# EasyEDA schematic RC Car Project Remote.json
TITLE: RC Car Project REMOTE; REV: 1.1; Date: 26/09/2022; Sheet: 1/1; Drawn By: Hugo MATHIEU; Company: BUT R&T, Aix-Marseille Université
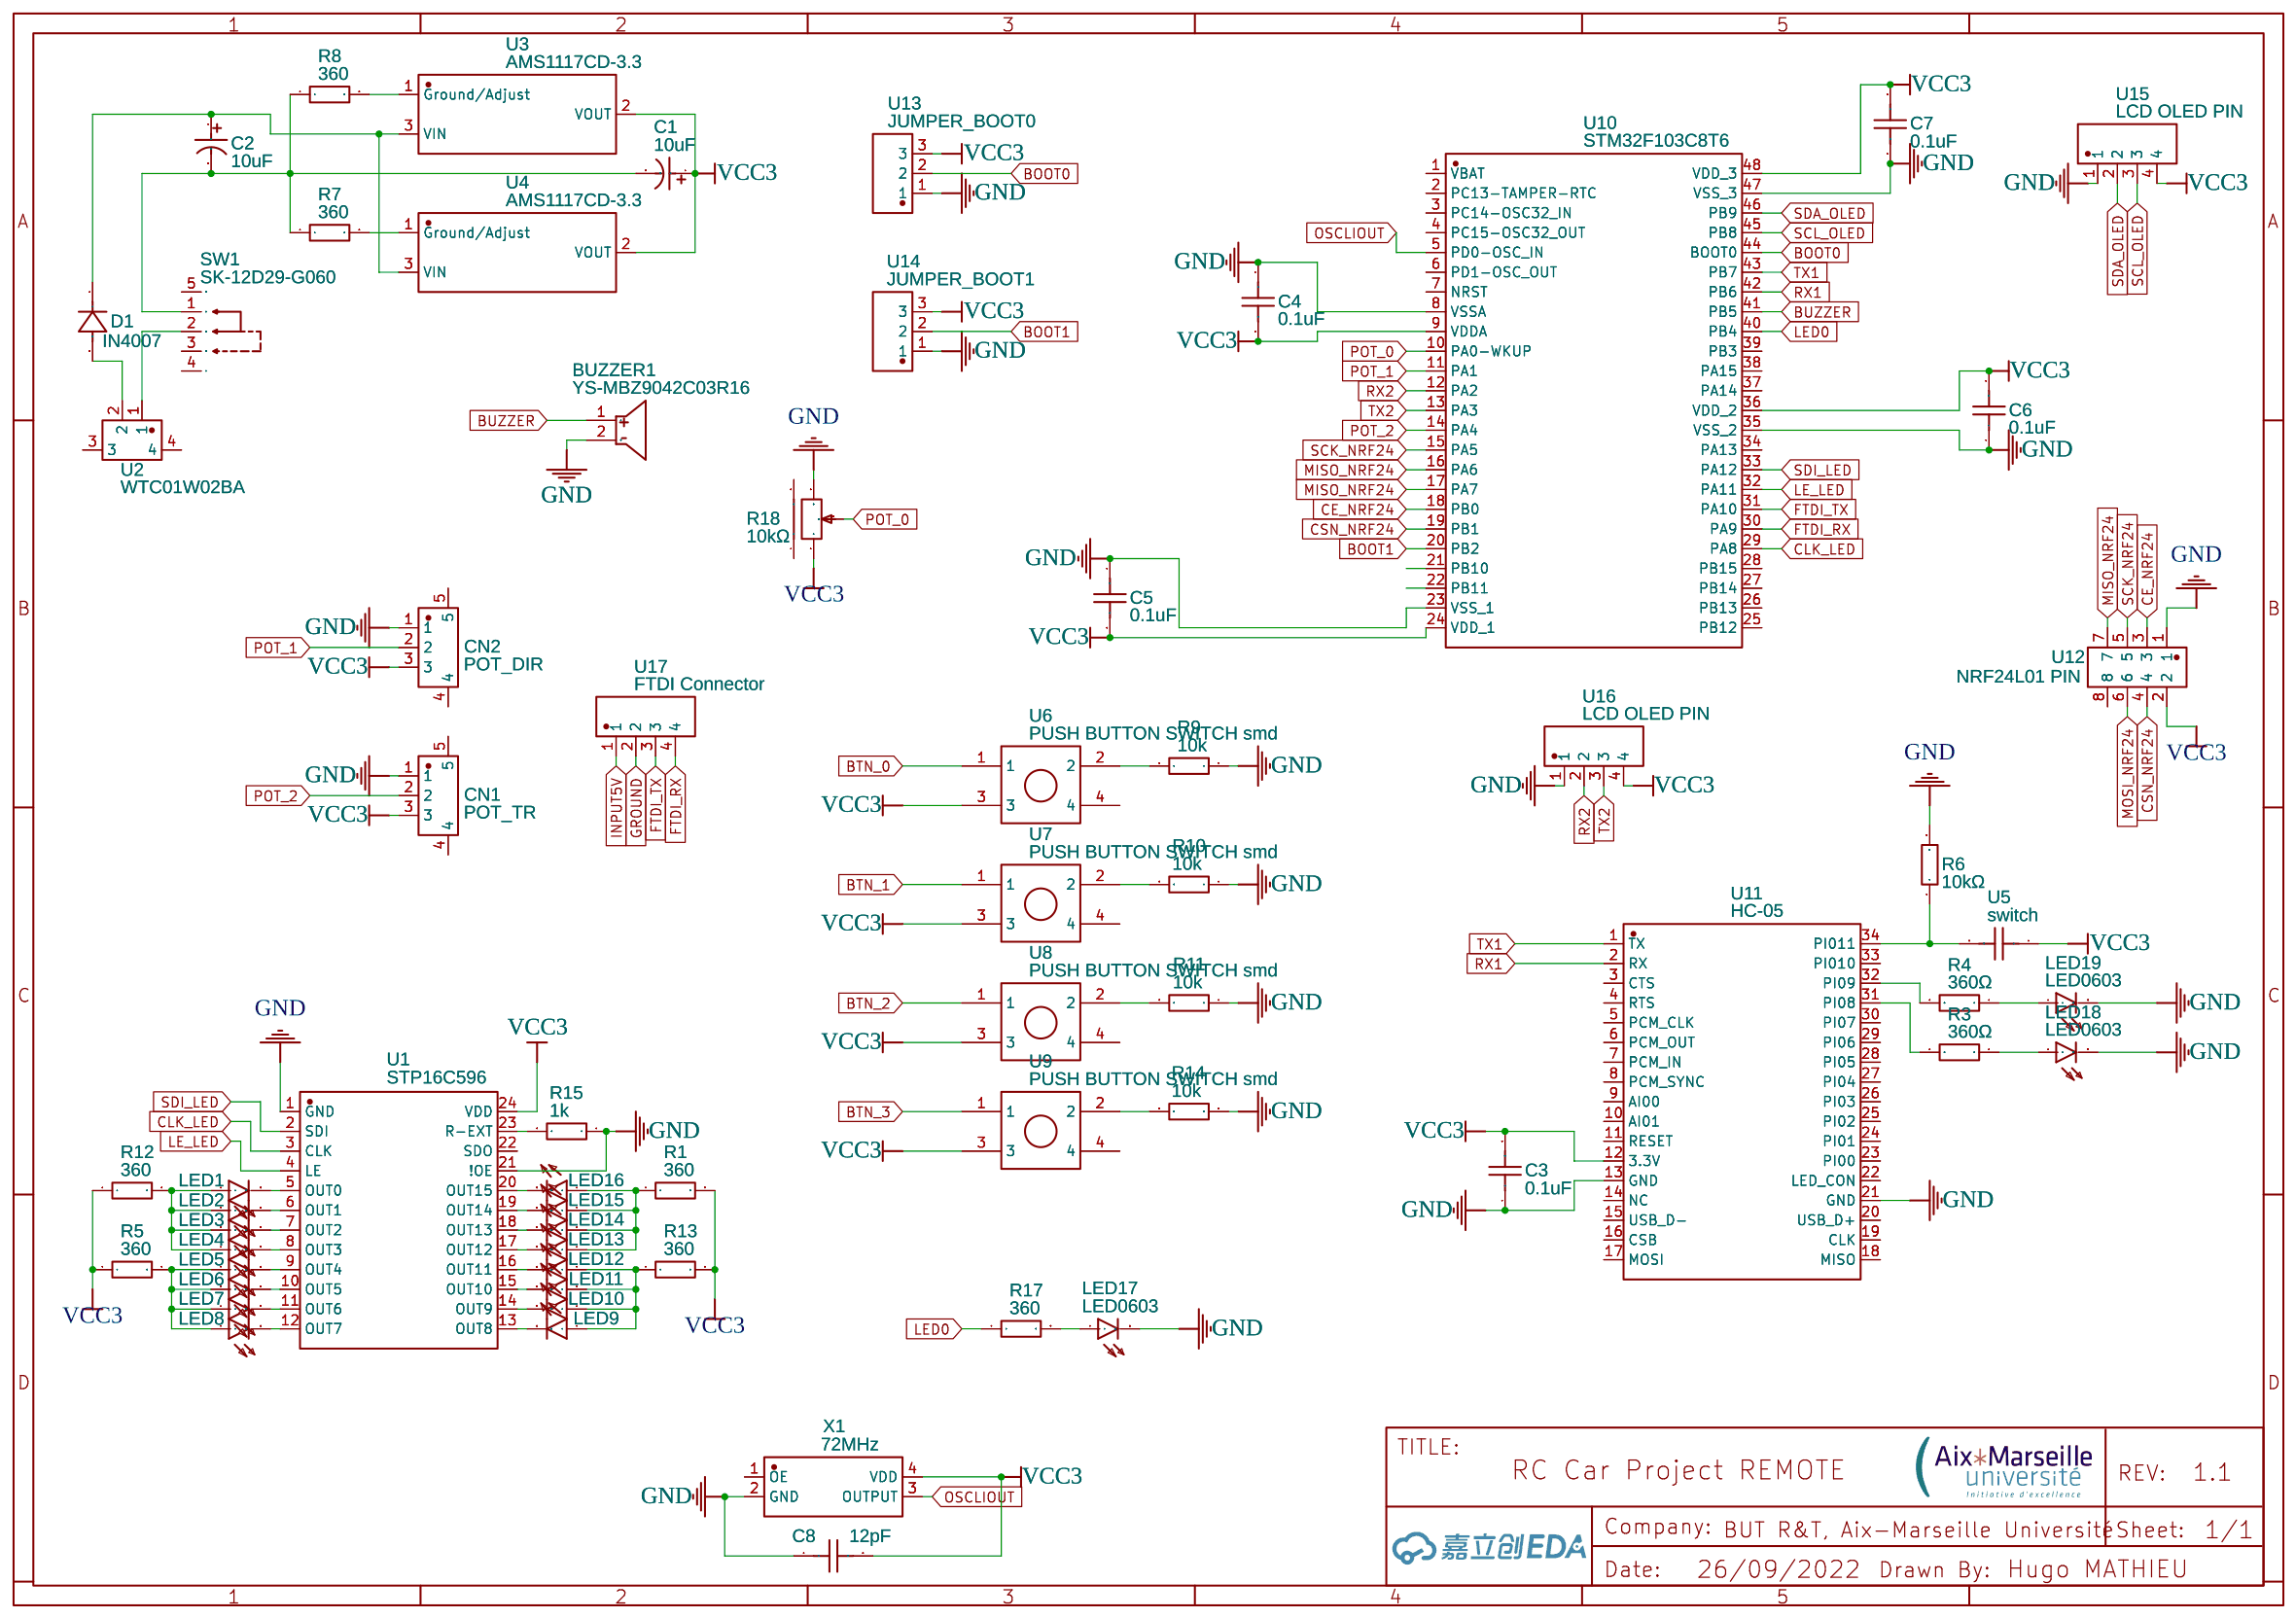
[diagram p0: schematic sheet]

## Parts
BUZZER1  YS-MBZ9042C03R16  [BUZ-TH_BD9.0-P4.00-D0.6-FD]
C1  10uF  [CAP-SMD_BD5.0-L5.3-W5.3-FD]
C2  10uF  [CAP-SMD_BD5.0-L5.3-W5.3-FD]
C3  0.1uF  [C0805]
C4  0.1uF  [C0805]
C5  0.1uF  [C0805]
C6  0.1uF  [C0805]
C7  0.1uF  [C0805]
C8  12pF  [C0805]
CN1  POT_TR  [CONN-SMD_3P-P1.25_1.25T-3PWT]
CN2  POT_DIR  [CONN-SMD_3P-P1.25_1.25T-3PWT]
D1  IN4007  [SMA_L4.3-W2.6-LS5.1-RD]
LED1  LED0603  [LED_CHIP-LED0603]
LED2  LED0603  [LED_CHIP-LED0603]
LED3  LED0603  [LED_CHIP-LED0603]
LED4  LED0603  [LED_CHIP-LED0603]
LED5  LED0603  [LED_CHIP-LED0603]
LED6  LED0603  [LED_CHIP-LED0603]
LED7  LED0603  [LED_CHIP-LED0603]
LED8  LED0603  [LED_CHIP-LED0603]
LED9  LED0603  [LED_CHIP-LED0603]
LED10  LED0603  [LED_CHIP-LED0603]
LED11  LED0603  [LED_CHIP-LED0603]
LED12  LED0603  [LED_CHIP-LED0603]
LED13  LED0603  [LED_CHIP-LED0603]
LED14  LED0603  [LED_CHIP-LED0603]
LED15  LED0603  [LED_CHIP-LED0603]
LED16  LED0603  [LED_CHIP-LED0603]
LED17  LED0603  [LED_CHIP-LED0603]
LED18  LED0603  [LED_CHIP-LED0603]
LED19  LED0603  [LED_CHIP-LED0603]
R1  360  [R0805]
R3  360Ω  [R1206]
R4  360Ω  [R1206]
R5  360  [R0805]
R6  10kΩ  [R1206]
R7  360  [R0805]
R8  360  [R0805]
R9  10k  [R0805]
R10  10k  [R0805]
R11  10k  [R0805]
R12  360  [R0805]
R13  360  [R0805]
R14  10k  [R0805]
R15  1k  [R0805]
R17  360  [R0805]
R18  10kΩ  [RES-ADJ-TH_RK09K1130AJ3]
SW1  SK-12D29-G060  [SW-TH_G-SWITCH_SK-12D29-G060]
U1  STP16C596  [HTSSOP-24]
U2  WTC01W02BA  [CONN-SMD_2P-P1.25_BZCN_WTC01W02BA]
U3  AMS1117CD-3.3  [TO-252-2_L6.6-W6.1-P4.57-LS9.9-BR-CW]
U4  AMS1117CD-3.3  [TO-252-2_L6.6-W6.1-P4.57-LS9.9-BR-CW]
U5  switch  [C0805]
U6  PUSH BUTTON SWITCH smd  [PUSH_BUTTON_6X6_SMD]
U7  PUSH BUTTON SWITCH smd  [PUSH_BUTTON_6X6_SMD]
U8  PUSH BUTTON SWITCH smd  [PUSH_BUTTON_6X6_SMD]
U9  PUSH BUTTON SWITCH smd  [PUSH_BUTTON_6X6_SMD]
U10  STM32F103C8T6  [LQFP-48_L7.0-W7.0-P0.50-LS9.0-BL]
U11  HC-05  [BULETM-SMD_HC-05]
U12  NRF24L01 PIN  [HDR-TH_8P-P2.54-V-F-R2-C4-S2.54]
U13  JUMPER_BOOT0  [HDR-TH_3P-P2.54-V-M-1]
U14  JUMPER_BOOT1  [HDR-TH_3P-P2.54-V-M-1]
U15  LCD OLED PIN  [HDR-TH_4P-P2.54-V-M-1]
U16  LCD OLED PIN  [HDR-TH_4P-P2.54-V-M-1]
U17  FTDI Connector  [HDR-TH_4P-P2.54-V-M-1]
X1  72MHz  [OSC-SMD_4P-L5.0-W3.2-BL_SG5032]

## Library data of the parts
BUZZER1 = YS-MBZ9042C03R16: Supplier: LCSC; Supplier Part: C409836; Manufacturer: Fengming; Contributor: LCSC; JLCPCB Part Class: Extended Part; Frequency: 2700Hz
C1 C2 = RVT1H100M0505: Supplier: LCSC; Manufacturer: ROQANG; Supplier Part: C72487; JLCPCB Part Class: Extended Part
C3-C8 = AC0805JRNPO9BN220: Supplier: LCSC; Supplier Part: C149614; Manufacturer: YAGEO; Contributor: LCSC; JLCPCB Part Class: Extended Part
CN1 CN2 = 1.25T-3PWT: Supplier: LCSC; Manufacturer: BOOMELE; Supplier Part: C22075; JLCPCB Part Class: Extended Part
D1 = IN4007: Supplier: LCSC; Supplier Part: C9900004719; JLCPCB Part Class: Extended Part; Contributor: LCSC
LED1-LED19 = LED_LEDCHIP-LED0603: Contributor: taboosh98
R1 R5 R7-R15 R17 = RC0805FR-07100RL: Supplier: LCSC; Manufacturer: YAGEO; Supplier Part: C105577; JLCPCB Part Class: Extended Part; Resistance: 100Ω
R3 R4 R6 = 1206W4F1002T5E: Supplier: LCSC; Manufacturer: UniOhm; Supplier Part: C17902; Resistance (Ohms): 10K; JLCPCB Part Class: Basic Part
R18 = RK09K1130AP5: Supplier: LCSC; Supplier Part: C470295; Manufacturer: ALPSALPINE(阿尔卑斯阿尔派); Contributor: lcsc; JLCPCB Part Class: Extended Part
SW1 = SK-12D29-G060: Supplier: LCSC; Supplier Part: C2848877; Manufacturer: G-Switch(品赞); Contributor: LCSC
U1 = STP16C596: Contributor: datKonny; Supplier Part: 914-2948; link: http://www.ti.com/product/DRV10983; Manufacturer: ST microelectronics
U2 = WTC01W02BA: Supplier: LCSC; Supplier Part: C5120226; Manufacturer: BZCN(博众电气); link: https://atta.szlcsc.com/upload/public/pdf/source/20220727/3388DBAC9C78C4D16ABF723F1601295B.pdf; Contributor: lcsc
U3 U4 = AMS1117CD-3.3: Supplier: LCSC; Supplier Part: C841796; Manufacturer: Advanced Monolithic Systems; Contributor: LCSC; JLCPCB Part Class: Extended Part
U5 = 0.5PF-C0805: Supplier: LCSC; Supplier Part: C9900009443; Manufacturer: null; Manufacturer Part: 0.5pF-C0805; link: https://atta.szlcsc.comnull; Contributor: LCSC; JLCPCB Part Class: Extended Part
U6-U9 = PUSH BUTTON SWITCH smd: Manufacturer Part: HALO PUSH BUTTON SWITCH; Contributor: CMDSEPCB
U10 = STM32F103C8T6: Supplier: LCSC; Manufacturer: STMicroelectronics; Supplier Part: C8734; JLCPCB Part Class: Basic Part
U11 = HC-05: Supplier: LCSC; Supplier Part: C9900001063; Manufacturer: null; JLCPCB Part Class: Extended Part; Contributor: LCSC
U12 = 2.54-2*4: Supplier: LCSC; Supplier Part: C2977588; Manufacturer: ZHOURI(洲日); link: https://atta.szlcsc.com/upload/public/pdf/source/20220328/363EB391BC0EB759CF231FC910753CBE.pdf; Contributor: LCSC
U13 U14 = 2.54*3单排: Supplier: LCSC; Supplier Part: C9900016162; Manufacturer: null; JLCPCB Part Class: Extended Part; Contributor: lcsc
U15-U17 = 2.54*4单排: Supplier: LCSC; Supplier Part: C9900016163; Manufacturer: null; JLCPCB Part Class: Extended Part; Contributor: lcsc
X1 = S5D13.560000A20F30T: Supplier: LCSC; Supplier Part: C387226; Manufacturer: Shenzhen SCTF Elec; Contributor: LCSC; JLCPCB Part Class: Extended Part

## Nets
GND: BUZZER1.2 C3.1 C4.1 C5.1 C6.1 C7.1 C8.1 CN1.1 CN2.1 LED17.C LED18.C LED19.C R6.2 R9.1 R10.1 R11.1 R14.1 R15.1 R18.3 U1.1(GND) U1.21(!OE) U10.8(VSSA) U10.23(VSS_1) U10.35(VSS_2) U10.47(VSS_3) U11.13(GND) U11.21(GND) U12.1 U13.1 U14.1 U15.1 U16.1 X1.2(GND)
VCC3: C1.1 C3.2 C4.2 C5.2 C6.2 C7.2 C8.2 CN1.3 CN2.3 R1.2 R5.1 R12.1 R13.2 R18.1 U1.24(VDD) U3.2(VOUT) U4.2(VOUT) U5.1 U6.3 U7.3 U8.3 U9.3 U10.9(VDDA) U10.24(VDD_1) U10.36(VDD_2) U10.48(VDD_3) U11.12(3.3V) U12.2 U13.3 U14.3 U15.4 U16.4 X1.4(VDD)
BOOT0: U10.44(BOOT0) U13.2
BOOT1: U10.20(PB2) U14.2
BTN_0: U6.1
BTN_1: U7.1
BTN_2: U8.1
BTN_3: U9.1
BUZZER: BUZZER1.1 U10.41(PB5)
CE_NRF24: U10.18(PB0) U12.3
CLK_LED: U1.3(CLK) U10.29(PA8)
CSN_NRF24: U10.19(PB1) U12.4
FTDI_RX: U10.30(PA9) U17.4
FTDI_TX: U10.31(PA10) U17.3
GROUND: U17.2
INPUT5V: U17.1
LE_LED: U1.4(LE) U10.32(PA11)
LED0: R17.1 U10.40(PB4)
MISO_NRF24: U10.16(PA6) U10.17(PA7) U12.7
MOSI_NRF24: U12.6
OSCLIOUT: U10.5(PD0-OSC_IN) X1.3(OUTPUT)
POT_0: R18.2 U10.10(PA0-WKUP)
POT_1: CN2.2 U10.11(PA1)
POT_2: CN1.2 U10.14(PA4)
RX1: U10.42(PB6) U11.2(RX)
RX2: U10.12(PA2) U16.2
SCK_NRF24: U10.15(PA5) U12.5
SCL_OLED: U10.45(PB8) U15.3
SDA_OLED: U10.46(PB9) U15.2
SDI_LED: U1.2(SDI) U10.33(PA12)
TX1: U10.43(PB7) U11.1(TX)
TX2: U10.13(PA3) U16.3
Net-(C1-2): C1.2 C2.2 R7.1 R8.1 SW1.1
Net-(C2-1): C2.1 D1.1(K) U3.3(VIN) U4.3(VIN)
Net-(D1-2): D1.2(A) U2.2
Net-(LED1-A): LED1.A LED2.A LED3.A LED4.A R12.2
Net-(LED1-C): LED1.C U1.5(OUT0)
Net-(LED2-C): LED2.C U1.6(OUT1)
Net-(LED3-C): LED3.C U1.7(OUT2)
Net-(LED4-C): LED4.C U1.8(OUT3)
Net-(LED5-A): LED5.A LED6.A LED7.A LED8.A R5.2
Net-(LED5-C): LED5.C U1.9(OUT4)
Net-(LED6-C): LED6.C U1.10(OUT5)
Net-(LED7-C): LED7.C U1.11(OUT6)
Net-(LED8-C): LED8.C U1.12(OUT7)
Net-(LED9-A): LED9.A LED10.A LED11.A LED12.A R13.1
Net-(LED9-C): LED9.C U1.13(OUT8)
Net-(LED10-C): LED10.C U1.14(OUT9)
Net-(LED11-C): LED11.C U1.15(OUT10)
Net-(LED12-C): LED12.C U1.16(OUT11)
Net-(LED13-A): LED13.A LED14.A LED15.A LED16.A R1.1
Net-(LED13-C): LED13.C U1.17(OUT12)
Net-(LED14-C): LED14.C U1.18(OUT13)
Net-(LED15-C): LED15.C U1.19(OUT14)
Net-(LED16-C): LED16.C U1.20(OUT15)
Net-(LED17-A): LED17.A R17.2
Net-(LED18-A): LED18.A R3.1
Net-(LED19-A): LED19.A R4.1
Net-(R3-2): R3.2 U11.31(PI08)
Net-(R4-2): R4.2 U11.32(PI09)
Net-(R6-1): R6.1 U5.2 U11.34(PI011)
Net-(R7-2): R7.2 U4.1(Ground/Adjust)
Net-(R8-2): R8.2 U3.1(Ground/Adjust)
Net-(R9-2): R9.2 U6.2
Net-(R10-2): R10.2 U7.2
Net-(R11-2): R11.2 U8.2
Net-(R14-2): R14.2 U9.2
Net-(R15-2): R15.2 U1.23(R-EXT)
Net-(SW1-2): SW1.2 U2.1

Not connected (* = marked no-connect by the designer): CN1 4 5; CN2 4 5; R18 4 5; SW1 3 4 5; U1 22(SDO); U2 3 4; U6 4; U7 4; U8 4; U9 4; U10 1(VBAT) 2(PC13-TAMPER-RTC) 3(PC14-OSC32_IN) 4(PC15-OSC32_OUT) 6(PD1-OSC_OUT) 7(NRST) 21(PB10) 22(PB11) 25(PB12) 26(PB13) 27(PB14) 28(PB15) 34(PA13) 37(PA14) 38(PA15) 39(PB3); U11 3(CTS) 4(RTS) 5(PCM_CLK) 6(PCM_OUT) 7(PCM_IN) 8(PCM_SYNC) 9(AI00) 10(AI01) 11(RESET) 14(NC) 15(USB_D-) 16(CSB) 17(MOSI) 18(MISO) 19(CLK) 20(USB_D+) 22(LED_CON) 23(PI00) 24(PI01) 25(PI02) 26(PI03) 27(PI04) 28(PI05) 29(PI06) 30(PI07) 33(PI010); U12 8; X1 1(OE)
